# Altium project ee_453_yourname.PrjPcb
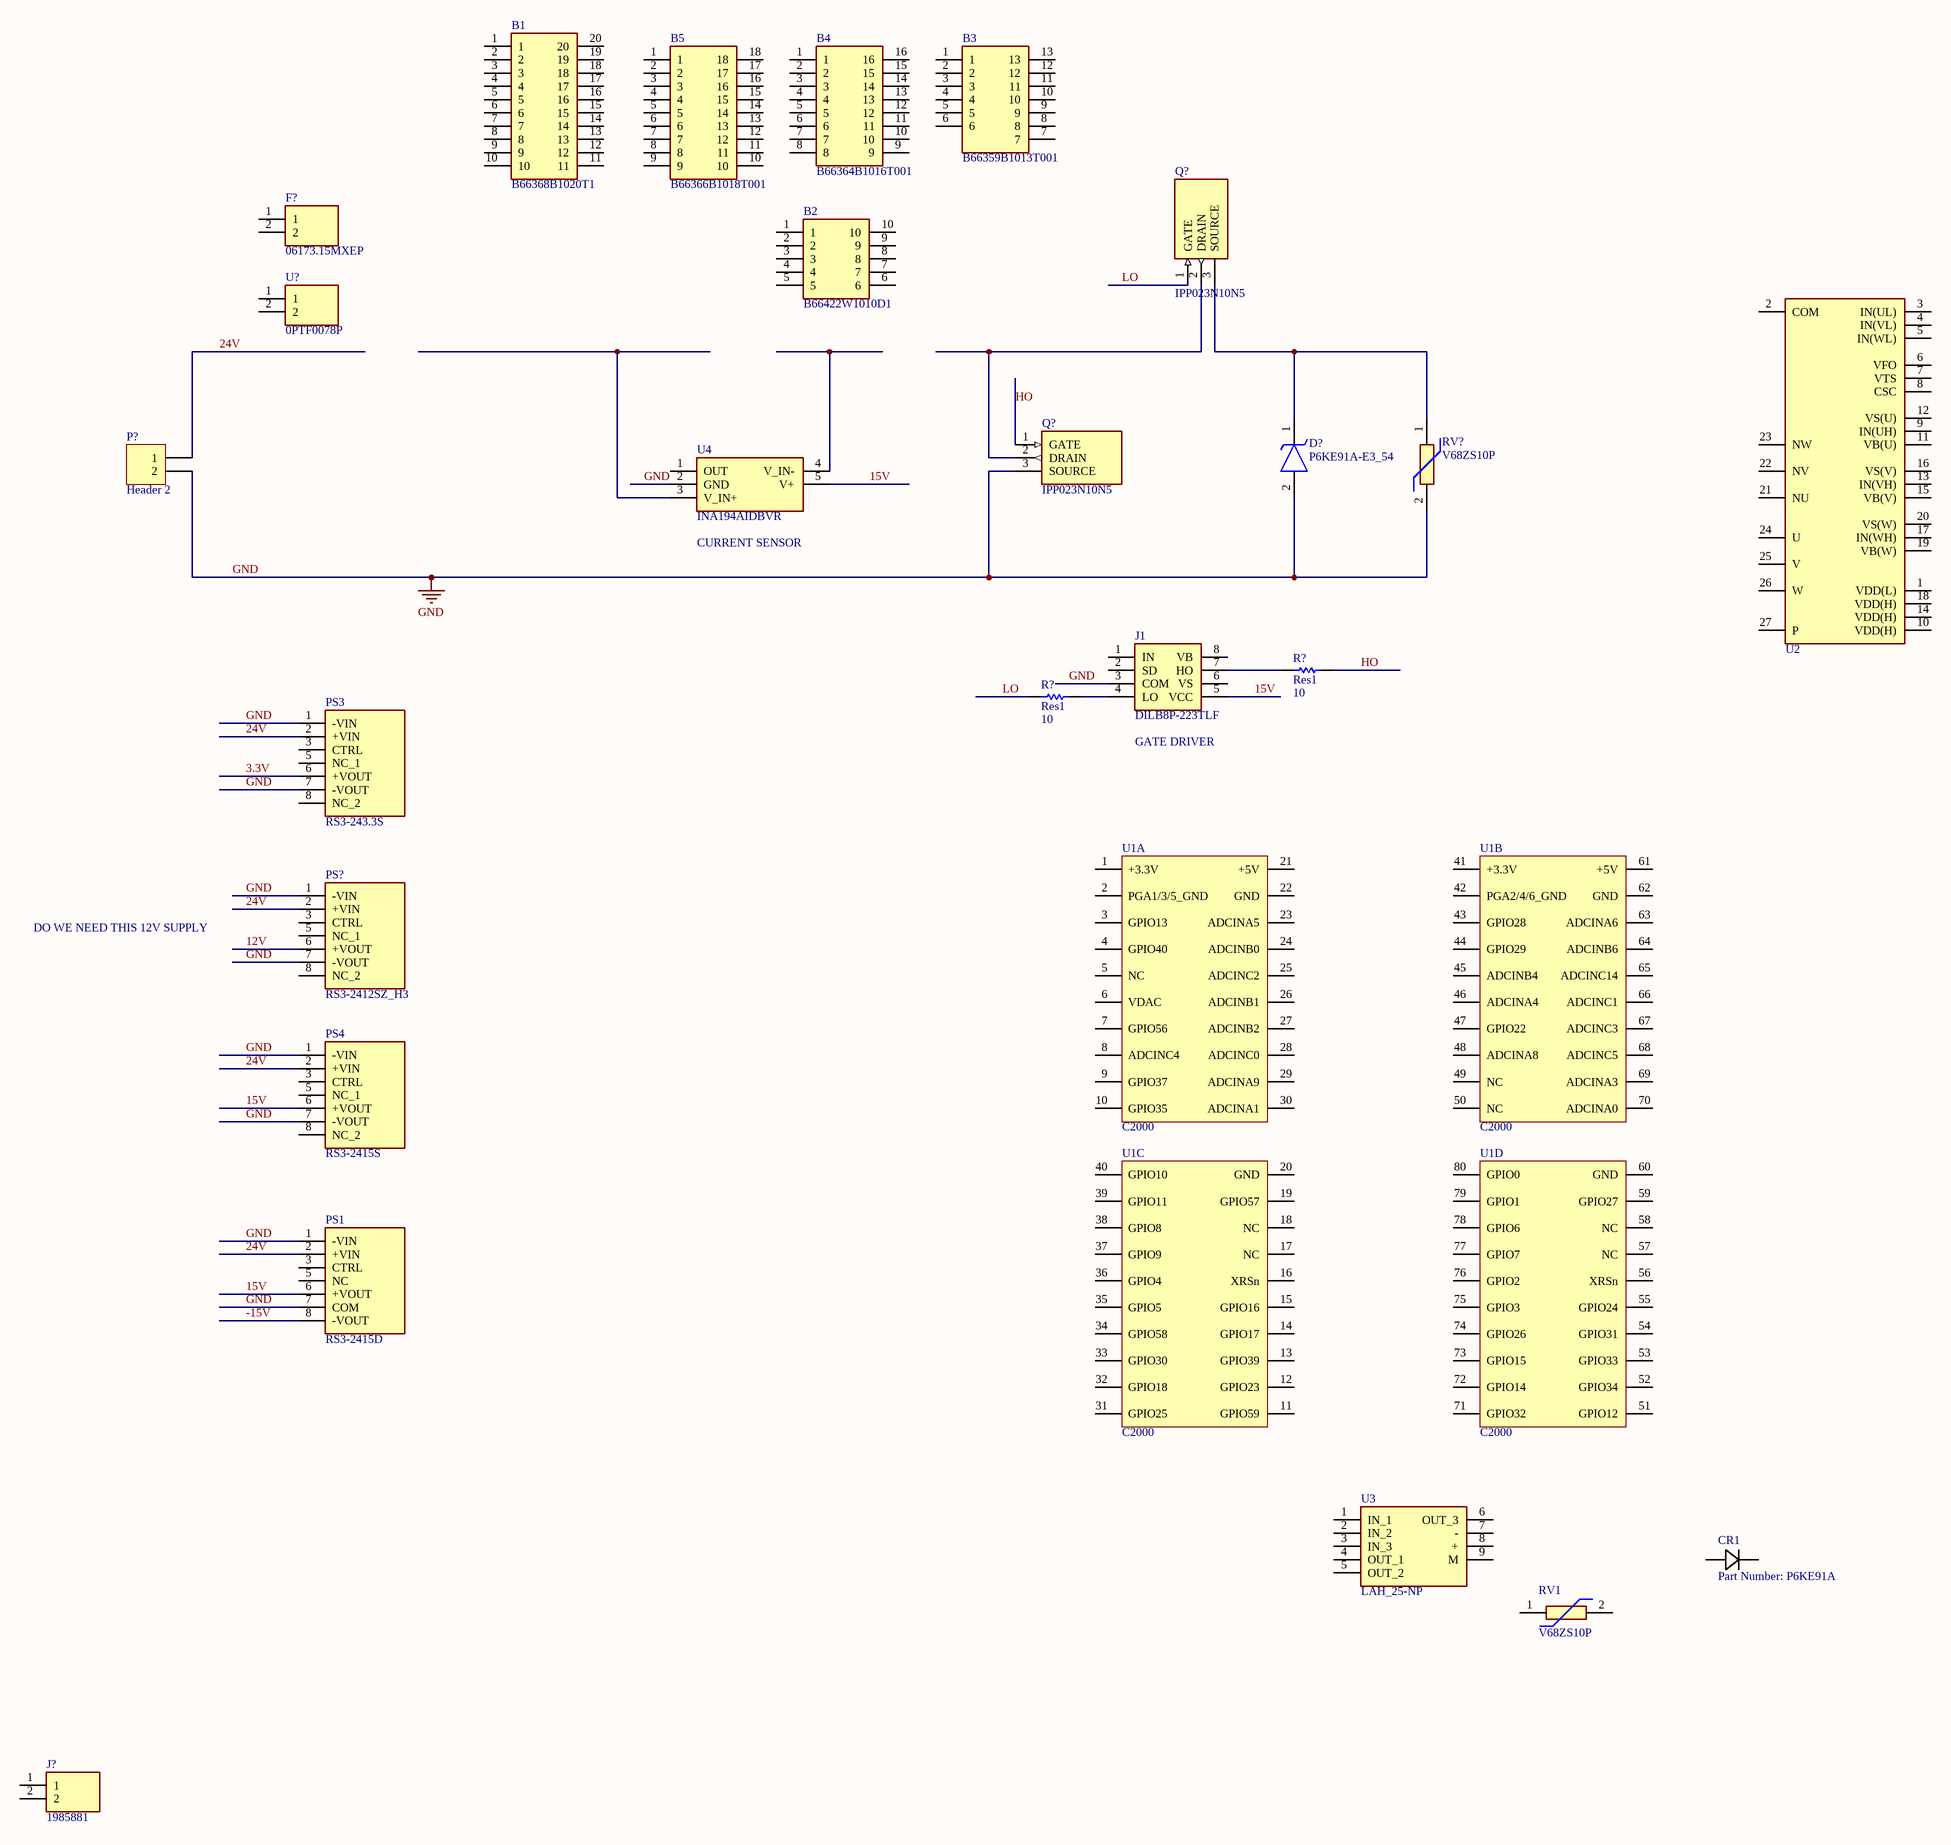
[diagram p0: ee453_pcb_yourname.SchDoc]
1 sheet, 26 parts. Net scope: global (net labels, ports and power ports of the same name join across sheets).
Board file: ee453_pcb_yourname.PcbDoc

## Sheet ee453_pcb_yourname.SchDoc: EE 453 Capstone
size C; ApprovedBy: Your Name; CheckedBy: Your Name; Author: Your Name; CompanyName: Dept. of Elec. and Comp. Engg.; DrawnBy: Your Name; Engineer: Your Nmae; Organization: UW-Seattle; Address1: 185 Stevens Way; Address2: Paul Allen Center; Address3: Seattle, WA; Address4: US-98195; DocumentNumber: 1; Revision: 1.0; SheetNumber: 1; SheetTotal: 1

### Parts
(Parts that share a designator on the sheet are numbered #1, #2 ... from top to bottom, then left to right.)
B1  B66368B1020T1  [B66368B1020T1]
B2  B66422W1010D1  [B66422W1010D1]
B3  B66359B1013T001  [B66359B1013T001]
B4  B66364B1016T001  [B66364B1016T001]
B5  B66366B1018T001  [B66366B1018T001]
CR1  Part Number: P6KE91A  [P6KESeries]
D?  P6KE91A-E3_54  [DIOAD1910W86L670D310]
F?  06173.15MXEP  [0617315MXEP]
J1  DILB8P-223TLF  [DIPS762W60P254L1016H525Q8N]
J?  1985881  [SHDR2W110P0X500_1X2_1000X985X1390P]
P?  Header 2  [HDR1X2]
PS1  RS3-2415D  [RS32405DH3]
PS3  RS3-243.3S  [RS32433S]
PS4  RS3-2415S  [RS32415S]
PS?  RS3-2412SZ_H3  [RS32405DH3]
Q?#1  IPP023N10N5  [TO254P457X1003X2115-3P]
Q?#2  IPP023N10N5  [TO254P457X1003X2115-3P]
R?#1  Res1  value 10  [AXIAL-0.3]
R?#2  Res1  value 10  [AXIAL-0.3]
RV1  V68ZS10P  [V68ZS10P]
RV?  V68ZS10P  [V68ZS10P]
U1  C2000  [C2000]  (parts A,B,C,D of 4)
U2  FNB34060T  [FNB34060T]  (value not drawn)
U3  LAH_25-NP  [LAH-25-NP]
U4  INA194AIDBVR  [SOT95P280X145-5N]
U?  0PTF0078P  [0PTF0078P]

### Nets
GND: D?.2(A) J1.3(COM) P?.2 PS1.1(-VIN) PS1.7(COM) PS3.1(-VIN) PS3.7(-VOUT) PS4.1(-VIN) PS4.7(-VOUT) PS?.1(-VIN) PS?.7(-VOUT) Q?#2.3(SOURCE) RV?.2 U4.2(GND)
3.3V: PS3.6(+VOUT)
12V: PS?.6(+VOUT)
15V: J1.5(VCC) PS1.6(+VOUT) PS4.6(+VOUT) U4.5(V+)
24V: P?.1 PS1.2(+VIN) PS3.2(+VIN) PS4.2(+VIN) PS?.2(+VIN)
-15V: PS1.8(-VOUT)
HO: Q?#2.1(GATE) R?#1.2
LO: Q?#1.1(GATE) R?#2.1
NetD?_1: D?.1(K) Q?#1.3(SOURCE) RV?.1
NetJ1_4: J1.4(LO) R?#2.2
NetJ1_7: J1.7(HO) R?#1.1
NetQ?#1_2: Q?#1.2(DRAIN) Q?#2.2(DRAIN)

Not connected (* = marked no-connect by the designer): B1 1 2 3 4 5 6 7 8 9 10 11 12 13 14 15 16 17 18 19 20; B2 1 2 3 4 5 6 7 8 9 10; B3 1 2 3 4 5 6 7 8 9 10 11 12 13; B4 1 2 3 4 5 6 7 8 9 10 11 12 13 14 15 16; B5 1 2 3 4 5 6 7 8 9 10 11 12 13 14 15 16 17 18; CR1 1 2; F? 1 2; J1 1(IN) 2(SD) 6(VS) 8(VB); J? 1 2; PS1 3(CTRL) 5(NC); PS3 3(CTRL) 5(NC_1) 8(NC_2); PS4 3(CTRL) 5(NC_1) 8(NC_2); PS? 3(CTRL) 5(NC_1) 8(NC_2); RV1 1 2; U1 1(+3.3V) 2(PGA1/3/5_GND) 3(GPIO13) 4(GPIO40) 5(NC) 6(VDAC) 7(GPIO56) 8(ADCINC4) 9(GPIO37) 10(GPIO35) 11(GPIO59) 12(GPIO23) 13(GPIO39) 14(GPIO17) 15(GPIO16) 16(XRSn) 17(NC) 18(NC) 19(GPIO57) 20(GND) 21(+5V) 22(GND) 23(ADCINA5) 24(ADCINB0) 25(ADCINC2) 26(ADCINB1) 27(ADCINB2) 28(ADCINC0) 29(ADCINA9) 30(ADCINA1) 31(GPIO25) 32(GPIO18) 33(GPIO30) 34(GPIO58) 35(GPIO5) 36(GPIO4) 37(GPIO9) 38(GPIO8) 39(GPIO11) 40(GPIO10) 41(+3.3V) 42(PGA2/4/6_GND) 43(GPIO28) 44(GPIO29) 45(ADCINB4) 46(ADCINA4) 47(GPIO22) 48(ADCINA8) 49(NC) 50(NC) 51(GPIO12) 52(GPIO34) 53(GPIO33) 54(GPIO31) 55(GPIO24) 56(XRSn) 57(NC) 58(NC) 59(GPIO27) 60(GND) 61(+5V) 62(GND) 63(ADCINA6) 64(ADCINB6) 65(ADCINC14) 66(ADCINC1) 67(ADCINC3) 68(ADCINC5) 69(ADCINA3) 70(ADCINA0) 71(GPIO32) 72(GPIO14) 73(GPIO15) 74(GPIO26) 75(GPIO3) 76(GPIO2) 77(GPIO7) 78(GPIO6) 79(GPIO1) 80(GPIO0); U2 1(VDD(L)) 2(COM) 3(IN(UL)) 4(IN(VL)) 5(IN(WL)) 6(VFO) 7(VTS) 8(CSC) 9(IN(UH)) 10(VDD(H)) 11(VB(U)) 12(VS(U)) 13(IN(VH)) 14(VDD(H)) 15(VB(V)) 16(VS(V)) 17(IN(WH)) 18(VDD(H)) 19(VB(W)) 20(VS(W)) 21(NU) 22(NV) 23(NW) 24(U) 25(V) 26(W) 27(P); U3 1(IN_1) 2(IN_2) 3(IN_3) 4(OUT_1) 5(OUT_2) 6(OUT_3) 7(-) 8(+) 9(M); U4 1(OUT) 3(V_IN+) 4(V_IN-); U? 1 2

### Notes on the sheet
- (near U4) CURRENT SENSOR
- (near J1) GATE DRIVER
- DO WE NEED THIS 12V SUPPLY
- Title
- Size:
- Date:
- File:
- C
- Number:
- Time:
- Revision:
- Sheet
- of

### Library data of the parts
B1 = B66368B1020T1: Bobbin; Manufacturer_Name: EPCOS; Datasheet Link: https://componentsearchengine.com/Datasheets/1/B66368B1020T1.pdf; Height: 40.9mm; Mouser2 Part Number: 871-B66368B1020T1; Mouser2 Price/Stock: https://www.mouser.com/Search/Refine.aspx?Keyword=871-B66368B1020T1; Manufacturer_Part_Number: B66368B1020T1
B2 = B66422W1010D1: Bobbin; Manufacturer_Name: EPCOS; Datasheet Link: https://componentsearchengine.com/Datasheets/1/B66422W1010D1.pdf; Height: 12mm; Mouser2 Part Number: 871-B66422W1010D1; Mouser2 Price/Stock: https://www.mouser.com/Search/Refine.aspx?Keyword=871-B66422W1010D1; Manufacturer_Part_Number: B66422W1010D1
B3 = B66359B1013T001: Bobbin; Manufacturer_Name: EPCOS; Datasheet Link: https://componentsearchengine.com/Datasheets/1/B66359B1013T001.pdf; Height: 25mm; Mouser2 Part Number: 871-B66359B1013T001; Mouser2 Price/Stock: https://www.mouser.com/Search/Refine.aspx?Keyword=871-B66359B1013T001; Manufacturer_Part_Number: B66359B1013T001
B4 = B66364B1016T001: Bobbin; Manufacturer_Name: EPCOS; Datasheet Link: https://componentsearchengine.com/Datasheets/1/B66364B1016T001.pdf; Height: 35.5mm; Mouser2 Part Number: 871-B66364B1016T001; Mouser2 Price/Stock: https://www.mouser.com/Search/Refine.aspx?Keyword=871-B66364B1016T001; Manufacturer_Part_Number: B66364B1016T001
B5 = B66366B1018T001: Bobbin; Manufacturer_Name: EPCOS; Datasheet Link: http://uk.rs-online.com/web/p/products/1620179; Height: 38.4mm; Manufacturer_Part_Number: B66366B1018T001; RS Part Number: 1620179; RS Price/Stock: http://uk.rs-online.com/web/p/products/1620179
CR1 = P6KE91A: No Description Available; Vendor: Littelfuse Inc; Built_By: EMA_UL_Team; Type: DEV; Manufacturer_Part_Number: P6KE91A; Copyright: Copyright (C) 2018 Accelerated Designs. All rights reserved; RefDes: RefDes; Value: Value
D? = P6KE91A-E3_54: TVS Diode (Uni-directional); Manufacturer_Name: Vishay; Manufacturer_Part_Number: P6KE91A-E3/54; Datasheet Link: https://www.mouser.com/datasheet/2/427/p6ke-1767850.pdf
F? = 06173.15MXEP: Fuse; Manufacturer_Name: LITTELFUSE; Datasheet Link: https://componentsearchengine.com/Datasheets/1/06173.15MXEP.pdf; Height: 5.8mm; Manufacturer_Part_Number: 06173.15MXEP; Mouser Part Number: 576-06173.15MXEP; Mouser Price/Stock: https://www.mouser.com/Search/Refine.aspx?Keyword=576-06173.15MXEP
J1 = DILB8P-223TLF: Connector; Manufacturer_Name: Amphenol; Datasheet Link: https://componentsearchengine.com/Datasheets/1/DILB8P-223TLF.pdf; Height: 5.25mm; Mouser2 Part Number: 649-DILB8P223TLF; Mouser2 Price/Stock: https://www.mouser.com/Search/Refine.aspx?Keyword=649-DILB8P223TLF; Manufacturer_Part_Number: DILB8P-223TLF
J? = 1985881: Connector; Manufacturer_Name: Phoenix Contact; Allied_Number: 70353630; Datasheet Link: https://www.phoenixcontact.com/online/portal/us?uri=pxc-oc-itemdetail:pid=1985881&library=usen&tab=1; Height: 13.9mm; Manufacturer_Part_Number: 1985881; Mouser Part Number: 651-1985881; Mouser Price/Stock: https://www.mouser.com/Search/Refine.aspx?Keyword=651-1985881; RS Part Number: 4670338; RS Price/Stock: http://uk.rs-online.com/web/p/products/4670338; Allied Price/Stock: https://www.alliedelec.com/phoenixcontact-1985881/70353630/
P? = Header 2: Header, 2-Pin; LatestRevisionDate: 17-Jul-2002; LatestRevisionNote: Re-released for DXP Platform.; Publisher: Altium Limited
PS1 = RS3-2415D: Power Supply; Manufacturer_Name: RECOM Power; Allied_Number: 70052275; Datasheet Link: https://www.recom-power.com/pdf/Econoline/RS3-S_D_Z.pdf; Height: 11.35mm; Manufacturer_Part_Number: RS3-2415D; Mouser Part Number: 919-RS3-2415D; Mouser Price/Stock: https://www.mouser.com/Search/Refine.aspx?Keyword=919-RS3-2415D; RS Part Number: 1669089; RS Price/Stock: https://uk.rs-online.com/web/p/products/1669089; Allied Price/Stock: https://www.alliedelec.com/recom-power-inc-rs3-2415d/70052275/
PS3 = RS3-243.3S: Power Supply; Manufacturer_Name: RECOM Power; Datasheet Link: https://www.arrow.com/en/products/rs3-243.3s/recom-power; Height: 11.35mm; Manufacturer_Part_Number: RS3-243.3S; Mouser Part Number: 919-RS3-243.3S; Mouser Price/Stock: https://www.mouser.com/Search/Refine.aspx?Keyword=919-RS3-243.3S; RS Part Number: 0163748P; RS Price/Stock: http://uk.rs-online.com/web/p/products/0163748P
PS4 = RS3-2415S: Power Supply; Manufacturer_Name: RECOM Power; Datasheet Link: https://www.recom-power.com/pdf/Econoline/RS3-S_D_Z.pdf; Height: 11.35mm; Manufacturer_Part_Number: RS3-2415S; Mouser Part Number: 919-RS3-2415S; Mouser Price/Stock: https://www.mouser.com/Search/Refine.aspx?Keyword=919-RS3-2415S
PS? = RS3-2412SZ_H3: Power Supply; Manufacturer_Name: RECOM Power; Manufacturer_Part_Number: RS3-2412SZ/H3; Datasheet Link: https://www.elpro.org/de/index.php?controller=attachment&id_attachment=8566; Height: 11.35mm; Mouser Part Number: 919-RS3-2412SZ/H3; Mouser Price/Stock: https://www.mouser.com/Search/Refine.aspx?Keyword=919-RS3-2412SZ%2FH3; RS Part Number: 1668891; RS Price/Stock: https://uk.rs-online.com/web/p/products/1668891
Q?#1 Q?#2 = IPP023N10N5: Transistor; Manufacturer_Name: Infineon; Datasheet Link: https://www.infineon.com/dgdl/Infineon-IPP023N10N5-DS-v02_03-EN.pdf?fileId=5546d461454603990145d5a675f86494; Height: 4.57mm; Manufacturer_Part_Number: IPP023N10N5; Mouser Part Number: 726-IPP023N10N5; Mouser Price/Stock: https://www.mouser.com/Search/Refine.aspx?Keyword=726-IPP023N10N5
R?#1 R?#2 = Res1: Resistor; Published: 8-Jun-2000; LatestRevisionDate: 17-Jul-2002; LatestRevisionNote: Re-released for DXP Platform.; PackageReference: AXIAL-0.3; Publisher: Altium Limited; PackageDescription: Axial Device, Thru-Hole; 2 Leads; 0.3 in Pin Spacing
RV1 RV? = V68ZS10P: Varistor; Manufacturer_Name: LITTELFUSE; Datasheet Link: http://www.littelfuse.com/~/media/electronics/datasheets/varistors/littelfuse_varistor_za_datasheet.pdf.pdf; Height: 20mm; Manufacturer_Part_Number: V68ZS10P
U1 = C2000: F280049C; Parameter 1: test 2
U3 = LAH_25-NP: Integrated Circuit; Manufacturer_Name: LEM; Manufacturer_Part_Number: LAH 25-NP; Datasheet Link: http://www.lem.com/docs/products/lah_25-np.pdf
U4 = INA194AIDBVR: Integrated Circuit; Manufacturer_Name: Texas Instruments; Datasheet Link: http://www.ti.com/lit/gpn/ina194; Height: 1.45mm; Manufacturer_Part_Number: INA194AIDBVR
U? = 0PTF0078P: Undefined or Miscellaneous; Manufacturer_Name: LITTELFUSE; Datasheet Link: https://media.digikey.com/pdf/Data%20Sheets/Littelfuse%20PDFs/PTF075_77_78.pdf; Height: 11.5mm; Manufacturer_Part_Number: 0PTF0078P; Mouser Part Number: 576-0PTF0078P; Mouser Price/Stock: https://www.mouser.com/Search/Refine.aspx?Keyword=576-0PTF0078P; RS Part Number: 1740656; RS Price/Stock: http://uk.rs-online.com/web/p/products/1740656